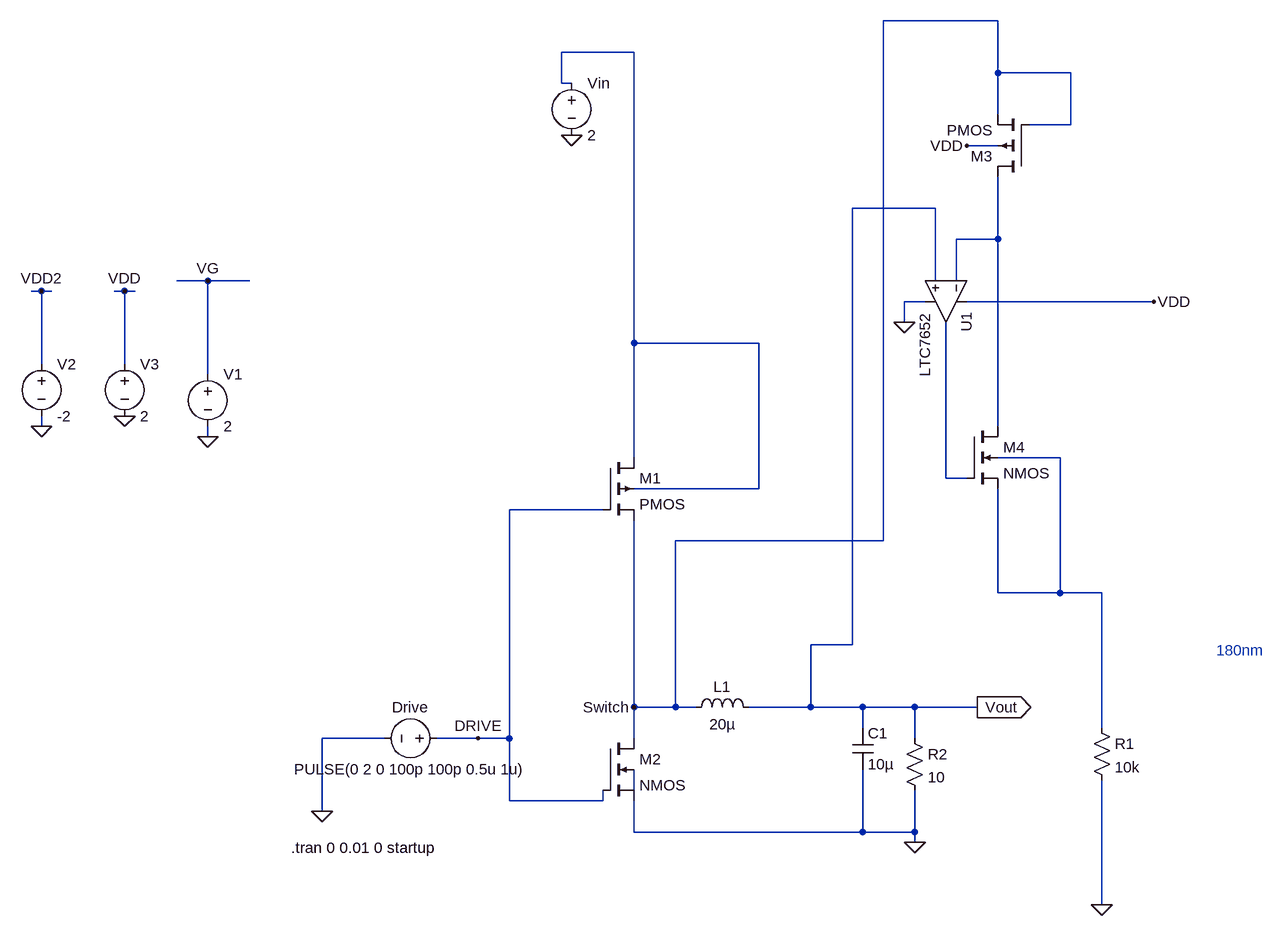
[diagram p0: schematic buck module.asc]
buck module.asc, the LTspice schematic file:
Version 4
SHEET 1 2436 2536
WIRE 224 -544 48 -544
WIRE -336 -496 -448 -496
WIRE 224 -464 224 -544
WIRE 336 -464 224 -464
WIRE -448 -448 -448 -496
WIRE -432 -448 -448 -448
WIRE 224 -400 224 -464
WIRE 336 -384 336 -464
WIRE 336 -384 272 -384
WIRE 224 -352 176 -352
WIRE 128 -256 0 -256
WIRE 224 -208 224 -304
WIRE 224 -208 160 -208
WIRE -992 -144 -1040 -144
WIRE -928 -144 -992 -144
WIRE 128 -144 128 -256
WIRE 160 -144 160 -208
WIRE -1248 -128 -1264 -128
WIRE -1232 -128 -1248 -128
WIRE -1120 -128 -1136 -128
WIRE -1104 -128 -1120 -128
WIRE 112 -112 80 -112
WIRE 464 -112 176 -112
WIRE 80 -80 80 -112
WIRE -336 -48 -336 -496
WIRE -144 -48 -336 -48
WIRE -1248 -16 -1248 -128
WIRE -1120 -16 -1120 -128
WIRE -992 0 -992 -144
WIRE -1248 80 -1248 64
WIRE 224 80 224 -208
WIRE -992 96 -992 80
WIRE -336 128 -336 -48
WIRE 320 128 224 128
WIRE 144 160 144 -80
WIRE 176 160 144 160
WIRE -144 176 -144 -48
WIRE -144 176 -336 176
WIRE -384 208 -528 208
WIRE 48 256 48 -544
WIRE 48 256 -272 256
WIRE 224 336 224 176
WIRE 320 336 320 128
WIRE 320 336 224 336
WIRE 384 336 320 336
WIRE 0 416 0 -256
WIRE 0 416 -64 416
WIRE -336 512 -336 224
WIRE -272 512 -272 256
WIRE -272 512 -336 512
WIRE -240 512 -272 512
WIRE -64 512 -64 416
WIRE -64 512 -160 512
WIRE 16 512 -64 512
WIRE 96 512 16 512
WIRE 192 512 96 512
WIRE 16 544 16 512
WIRE 384 544 384 336
WIRE -720 560 -816 560
WIRE -576 560 -640 560
WIRE -528 560 -528 208
WIRE -528 560 -576 560
WIRE -336 560 -336 512
WIRE 96 560 96 512
WIRE -336 640 -336 608
WIRE -528 656 -528 560
WIRE -384 656 -384 640
WIRE -384 656 -528 656
WIRE -816 672 -816 560
WIRE -336 704 -336 656
WIRE 16 704 16 608
WIRE 16 704 -336 704
WIRE 96 704 96 640
WIRE 96 704 16 704
WIRE 96 720 96 704
WIRE 384 816 384 624
FLAG -816 672 0
FLAG -432 -368 0
FLAG -336 512 Switch
FLAG 192 512 Vout
IOPIN 192 512 Out
FLAG -1120 64 0
FLAG -1248 80 0
FLAG 464 -112 VDD
FLAG -1120 -128 VDD
FLAG -1248 -128 VDD2
FLAG -992 96 0
FLAG -992 -144 VG
FLAG -576 560 DRIVE
FLAG 176 -352 VDD
FLAG 80 -80 0
FLAG 96 720 0
FLAG 384 816 0
SYMBOL ind -256 528 R270
WINDOW 0 32 56 VTop 2
WINDOW 3 5 56 VBottom 2
SYMATTR InstName L1
SYMATTR Value 20µ
SYMBOL cap 0 544 R0
SYMATTR InstName C1
SYMATTR Value 10µ
SYMBOL voltage -624 560 R90
WINDOW 0 -32 56 VBottom 2
WINDOW 3 32 56 VTop 2
WINDOW 123 0 0 Left 0
WINDOW 39 0 0 Left 0
SYMATTR InstName Drive
SYMATTR Value PULSE(0 2 0 100p 100p 0.5u 1u)
SYMBOL pmos4 -384 128 R0
SYMATTR InstName M1
SYMATTR Value2 l=180nm w=1000m
SYMBOL nmos4 -384 560 R0
SYMATTR InstName M2
SYMATTR Value2 l=180n w=500m
SYMBOL voltage -432 -464 R0
WINDOW 123 0 0 Left 0
WINDOW 39 0 0 Left 0
SYMATTR InstName Vin
SYMATTR Value 2
SYMBOL res 80 544 R0
SYMATTR InstName R2
SYMATTR Value 10
SYMBOL pmos4 272 -304 R180
SYMATTR InstName M3
SYMATTR Value2 l=180nm w=10m
SYMBOL nmos4 176 80 R0
SYMATTR InstName M4
SYMATTR Value2 l=0.18u w=5m
SYMBOL voltage -1248 -32 R0
WINDOW 123 0 0 Left 0
WINDOW 39 0 0 Left 0
SYMATTR InstName V2
SYMATTR Value -2
SYMBOL voltage -1120 -32 R0
WINDOW 123 0 0 Left 0
WINDOW 39 0 0 Left 0
SYMATTR InstName V3
SYMATTR Value 2
SYMBOL voltage -992 -16 R0
WINDOW 123 0 0 Left 0
WINDOW 39 0 0 Left 0
SYMATTR InstName V1
SYMATTR Value 2
SYMBOL OpAmps\\LTC7652 208 -112 R90
SYMATTR InstName U1
SYMBOL res 368 528 R0
SYMATTR InstName R1
SYMATTR Value 10k
TEXT 560 424 Left 2 ;180nm
TEXT -864 728 Left 2 !.tran 0 0.01 0 startup

The netlist it stands for:
* buck module.asc
L1 Switch Vout 20µ
C1 Vout 0 10µ
V§Drive DRIVE 0 PULSE(0 2 0 100p 100p 0.5u 1u)
M1 N001 DRIVE Switch N001 PMOS l=180nm w=1000m
M2 Switch DRIVE 0 N005 NMOS l=180n w=500m
Vin N001 0 2
R2 Vout 0 10
M3 N002 Switch Switch VDD PMOS l=180nm w=10m
M4 N002 N004 N003 N003 NMOS l=0.18u w=5m
V2 VDD2 0 -2
V3 VDD 0 2
V1 VG 0 2
XU1 Vout N002 VDD 0 N004 LTC1052  ; LTC7652, pins In+ In- V+ V- OUT
R1 N003 0 10k
.model NMOS NMOS
.model PMOS PMOS
.lib standard.mos
* 180nm
.tran 0 0.01 0 startup
.backanno
.end